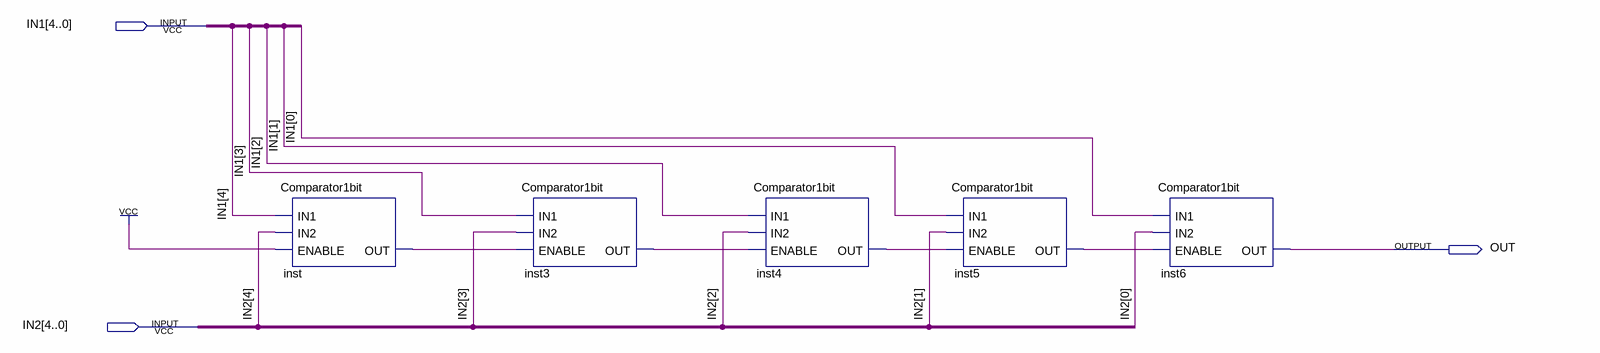
[diagram p0: schematic sheet]
// Quartus schematic Comparator5bit.bdf as structural Verilog: 5 symbols, 3 pins
module Comparator5bit (
  input  [4:0] IN1,
  input  [4:0] IN2,
  output OUT
);

  wire inst3_out, inst4_out, inst5_out, inst_out;

  Comparator1bit inst (.IN1(IN1[4]), .IN2(IN2[4]), .ENABLE(1'b1), .OUT(inst_out));
  Comparator1bit inst3 (.IN1(IN1[3]), .IN2(IN2[3]), .ENABLE(inst_out), .OUT(inst3_out));
  Comparator1bit inst4 (.IN1(IN1[2]), .IN2(IN2[2]), .ENABLE(inst3_out), .OUT(inst4_out));
  Comparator1bit inst5 (.IN1(IN1[1]), .IN2(IN2[1]), .ENABLE(inst4_out), .OUT(inst5_out));
  Comparator1bit inst6 (.IN1(IN1[0]), .IN2(IN2[0]), .ENABLE(inst5_out), .OUT(OUT));
endmodule
